# Altium project Cubesat OBC.PrjPcb
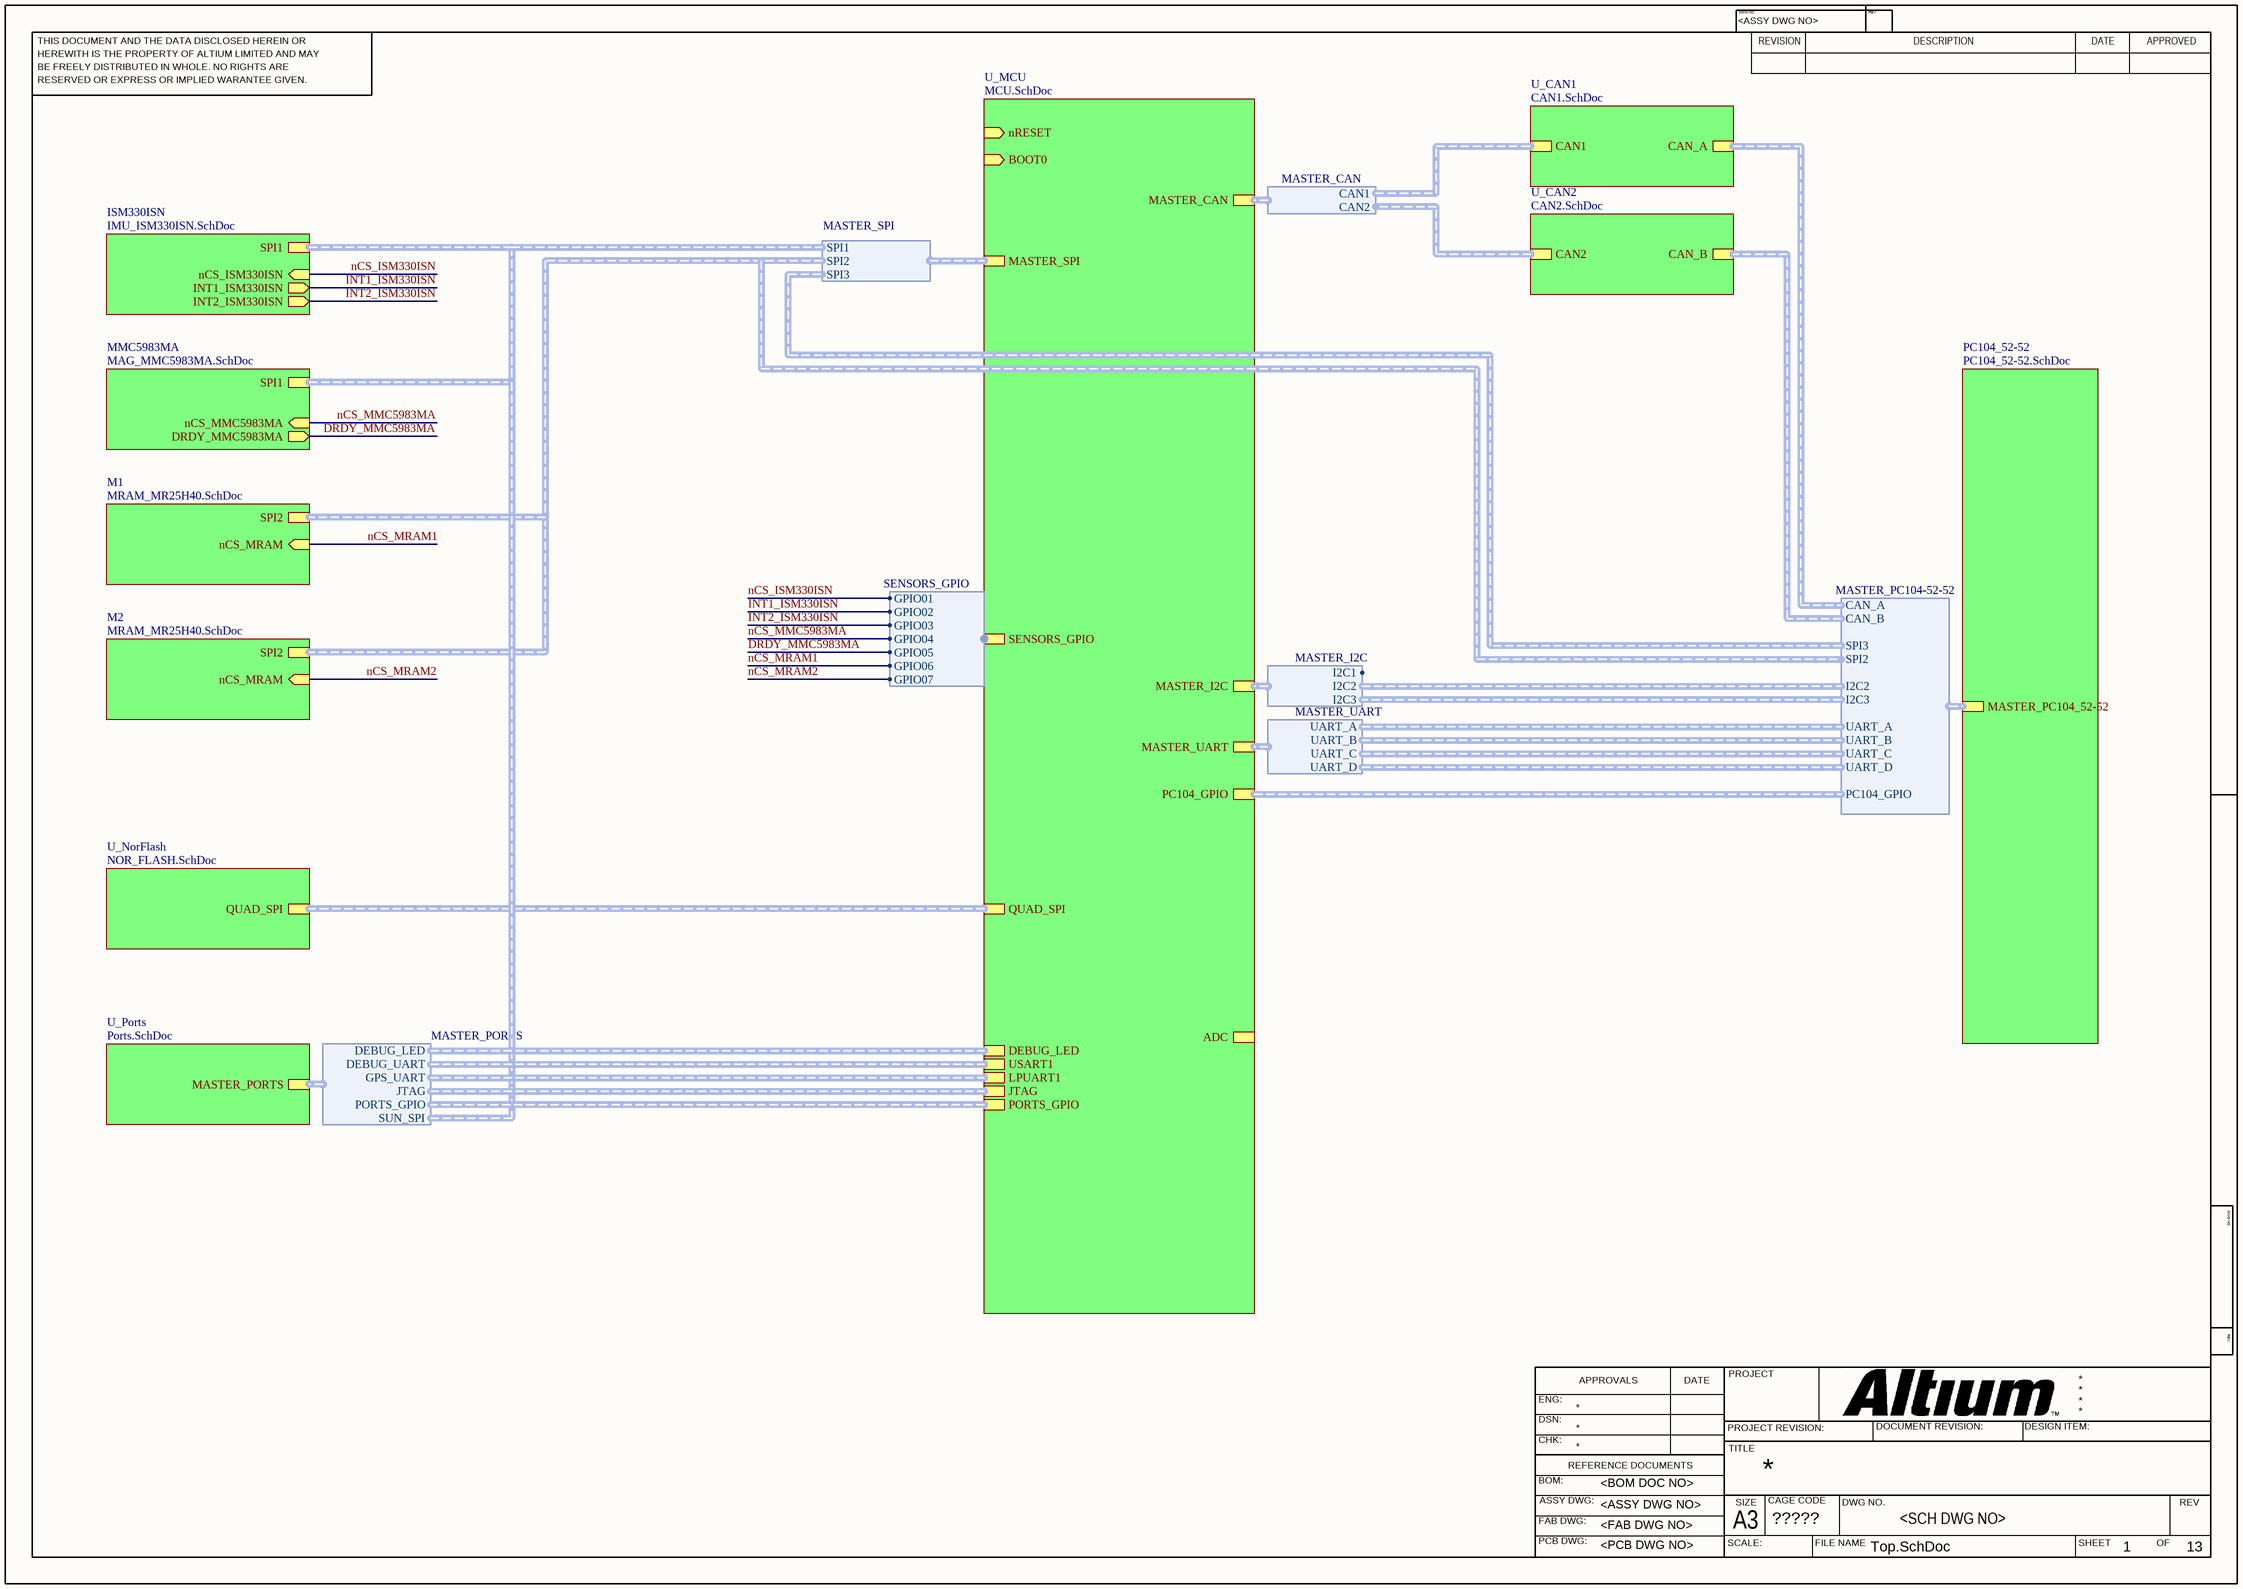
[diagram p0: Top.SchDoc]
CAGE_CODE: ?????; CONTRACT_NUMBER: <CONTRACT NO>; DOC_NO_ASSY_DWG: <ASSY DWG NO>; DOC_NO_BOM: <BOM DOC NO>; DOC_NO_FAB_DWG: <FAB DWG NO>; DOC_NO_SCH_DWG: <SCH DWG NO>; PCB_2_DEC_TOL: +/-.01; PCB_3_DEC_TOL: +/-.010; PCB_ANG_TOL: +/-1/2; PCB_ASSEMBLY_NO: <PCB ASSY NO>; PCB_CHECKER: - -----; PCB_CHECKER_APP_DATE: --/--/----; PCB_DESIGNER: - -----; PCB_DESIGNER_APP_DATE: --/--/----; PCB_DWG_NO: <PCB DWG NO>; PCB_ENGINEER: - -----; PCB_ENGINEER_APP_DATE: --/--/----; PCB_PART_NUMBER: <PCB PN>; PCB_REV: A; SCH_REV: A
5 sheets, 68 parts. Net scope: hierarchical (ports join the sheet entries above them; power ports are global).
Board file: CORE.PcbDoc
Sheets:
  Top.SchDoc
    U_MCU = MCU.SchDoc
      MCU_Power = MCU_Power.SchDoc
    PC104_52-52 = PC104_52-52.SchDoc
    U_Ports = Ports.SchDoc

## Sheet Top.SchDoc
size 420 x 297 mm; SheetNumber: 1; SheetTotal: 13

### Sub-sheets
ISM330ISN = IMU_ISM330ISN.SchDoc (file not in this document): SPI1 (harness SPI1), nCS_ISM330ISN (in), INT1_ISM330ISN (out), INT2_ISM330ISN (out)
M1 = MRAM_MR25H40.SchDoc (file not in this document): nCS_MRAM (in), SPI2 (harness SPI2)
M2 = MRAM_MR25H40.SchDoc (file not in this document): nCS_MRAM (in), SPI2 (harness SPI2)
MMC5983MA = MAG_MMC5983MA.SchDoc (file not in this document): nCS_MMC5983MA (in), SPI1 (harness SPI1), DRDY_MMC5983MA (out)
PC104_52-52 = PC104_52-52.SchDoc: MASTER_PC104_52-52 (harness MASTER_PC104-52-52)
U_CAN1 = CAN1.SchDoc (file not in this document): CAN_A (harness CAN_A), CAN1 (harness CAN1)
U_CAN2 = CAN2.SchDoc (file not in this document): CAN_B (harness CAN_b), CAN2 (harness CAN2)
U_MCU = MCU.SchDoc: MASTER_I2C (harness MASTER_I2C), MASTER_SPI (harness MASTER_SPI), MASTER_UART (harness MASTER_UART), MASTER_CAN (harness MASTER_CAN), QUAD_SPI (harness QUAD_SPI), nRESET (in), BOOT0 (in), JTAG (harness JTAG), DEBUG_LED (harness DEBUG_LED), USART1 (harness USART1), ADC (harness ADC), LPUART1 (harness LPUART1), PC104_GPIO (harness PC104_GPIO), PORTS_GPIO (harness PORTS_GPIO), SENSORS_GPIO (harness SENSORS_GPIO)
U_NorFlash = NOR_FLASH.SchDoc (file not in this document): QUAD_SPI (harness QUAD_SPI)
U_Ports = Ports.SchDoc: MASTER_PORTS (harness MASTER_PORTS)

### Harnesses
MASTER_SPI: SPI1, SPI2, SPI3
MASTER_CAN: CAN1, CAN2
MASTER_UART: UART_A, UART_B, UART_C, UART_D
MASTER_I2C: I2C2, I2C3, I2C1
SENSORS_GPIO: GPIO01, GPIO02, GPIO03, GPIO04, GPIO05, GPIO06, GPIO07
MASTER_PC104-52-52: CAN_A, CAN_B, I2C2, I2C3, PC104_GPIO, SPI2, SPI3, UART_A, UART_B, UART_C, UART_D
MASTER_PORTS: DEBUG_LED, DEBUG_UART, GPS_UART, JTAG, PORTS_GPIO, SUN_SPI

### Nets
DRDY_MMC5983MA: sheet MMC5983MA/DRDY_MMC5983MA, sheet U_MCU/SENSORS_GPIO.GPIO05
INT1_ISM330ISN: sheet ISM330ISN/INT1_ISM330ISN, sheet U_MCU/SENSORS_GPIO.GPIO02
INT2_ISM330ISN: sheet ISM330ISN/INT2_ISM330ISN, sheet U_MCU/SENSORS_GPIO.GPIO03
nCS_ISM330ISN: sheet ISM330ISN/nCS_ISM330ISN, sheet U_MCU/SENSORS_GPIO.GPIO01
nCS_MMC5983MA: sheet MMC5983MA/nCS_MMC5983MA, sheet U_MCU/SENSORS_GPIO.GPIO04
nCS_MRAM1: sheet M1/nCS_MRAM, sheet U_MCU/SENSORS_GPIO.GPIO06
nCS_MRAM2: sheet M2/nCS_MRAM, sheet U_MCU/SENSORS_GPIO.GPIO07

### Buses and harness runs
harness sheet ISM330ISN/SPI1 = sheet MMC5983MA/SPI1
harness sheet M1/SPI2 = sheet M2/SPI2
harness sheet U_MCU/QUAD_SPI = sheet U_NorFlash/QUAD_SPI

### Notes on the sheet
- THIS DOCUMENT AND THE DATA DISCLOSED HEREIN OR
- HEREWITH IS THE PROPERTY OF ALTIUM LIMITED AND MAY
- DWG NO:
- REVISION
- REV:
- DESCRIPTION
- DATE
- APPROVED
- BE FREELY DISTRIBUTED IN WHOLE. NO RIGHTS ARE
- RESERVED OR EXPRESS OR IMPLIED WARANTEE GIVEN.
- ENG:
- APPROVALS
- PROJECT
- DSN:
- CHK:
- REFERENCE DOCUMENTS
- PROJECT REVISION:
- TITLE
- DOCUMENT REVISION:
- DESIGN ITEM:
- BOM:
- FAB DWG:
- PCB DWG:
- ASSY DWG:
- SCALE:
- A3
- SIZE
- CAGE CODE
- FILE NAME
- DWG NO.
- SHEET
- OF
- REV

## Sheet MCU.SchDoc
size 420 x 297 mm; SheetNumber: 2; SheetTotal: 13; ENG_APP_DATE: --/--/--; DSN_APP_DATE: --/--/--; CHK_APP_DATE: --/--/--
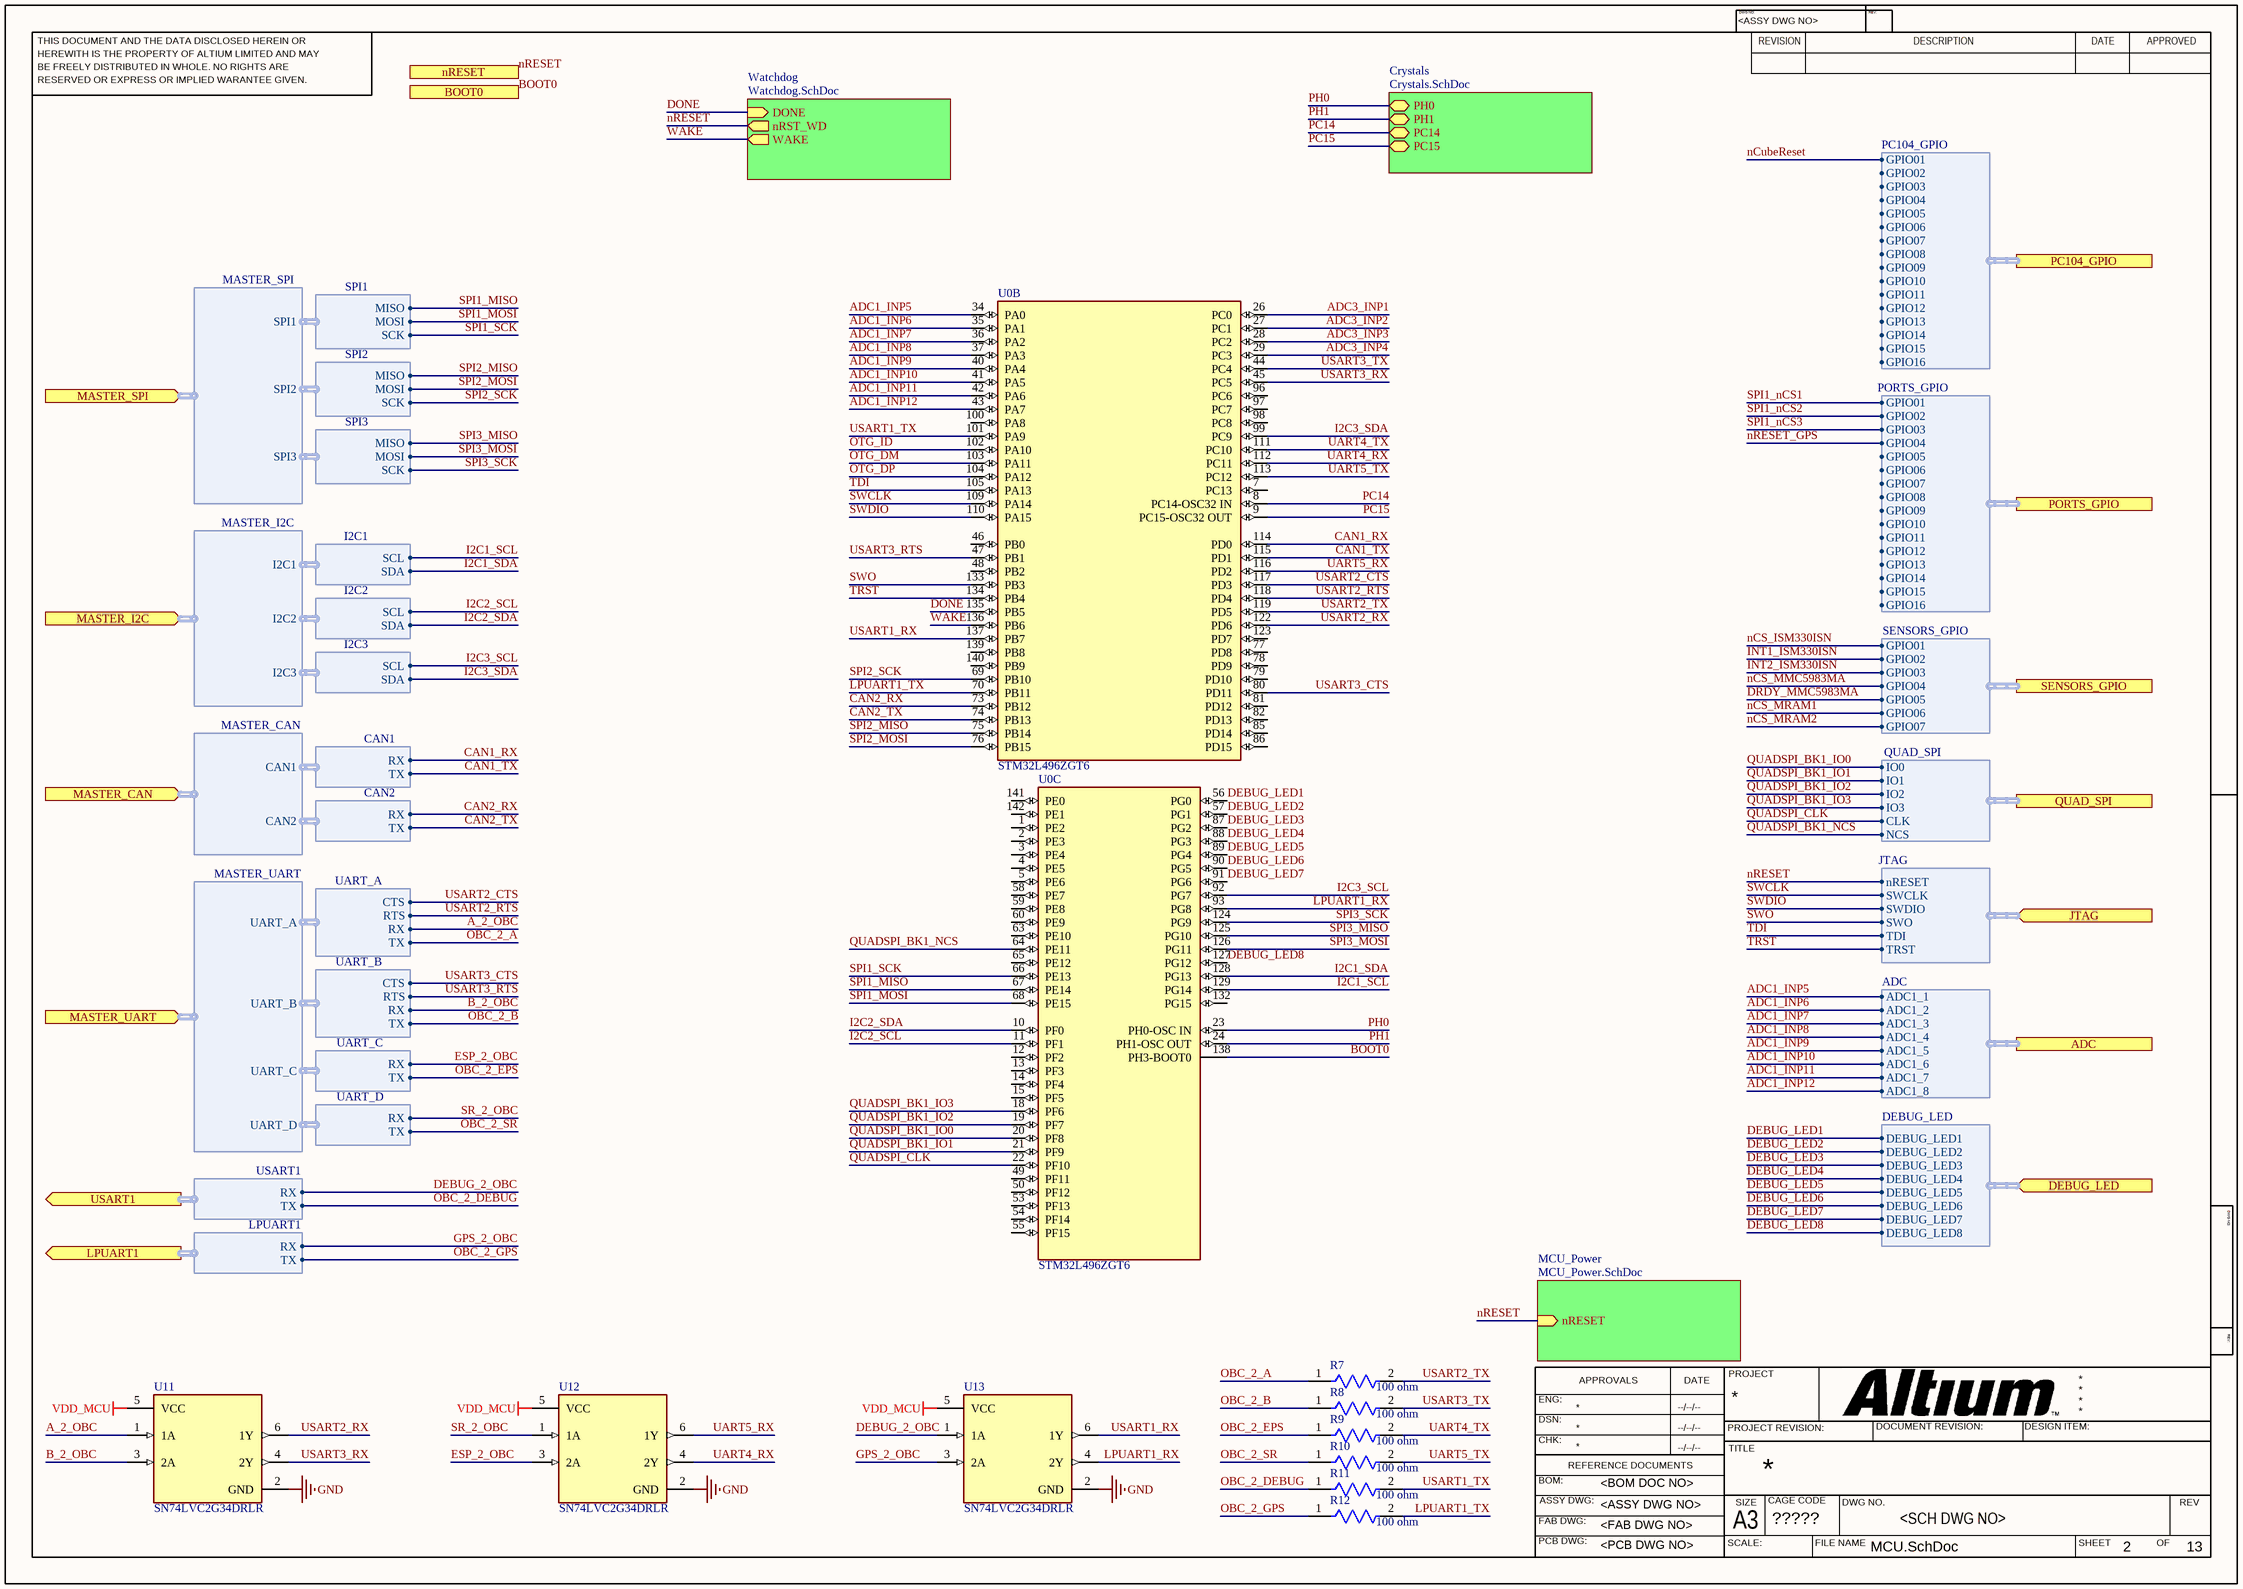
[diagram p1: MCU.SchDoc]

### Parts
R7  100 ohm  [FP-ERJP03-MFG]
R8  100 ohm  [FP-ERJP03-MFG]
R9  100 ohm  [FP-ERJP03-MFG]
R10  100 ohm  [FP-ERJP03-MFG]
R11  100 ohm  [FP-ERJP03-MFG]
R12  100 ohm  [FP-ERJP03-MFG]
U0  STM32L496ZGT6  [FP-LQFP144-1A-MFG]  (parts B,C of 3)
U11  SN74LVC2G34DRLR  [FP-DRL0006A-MFG]
U12  SN74LVC2G34DRLR  [FP-DRL0006A-MFG]
U13  SN74LVC2G34DRLR  [FP-DRL0006A-MFG]

### Sub-sheets
Crystals = Crystals.SchDoc (file not in this document): PC14 (bidir), PC15 (bidir), PH0 (bidir), PH1 (bidir)
MCU_Power = MCU_Power.SchDoc: nRESET (in)
Watchdog = Watchdog.SchDoc (file not in this document): nRST_WD (out), DONE (in), WAKE (out)

### Ports
ADC (harness ADC), BOOT0 (in), DEBUG_LED (in, harness DEBUG_LED), JTAG (in, harness JTAG), LPUART1 (out, harness LPUART1), MASTER_CAN (in, harness MASTER_CAN), MASTER_I2C (in, harness MASTER_I2C), MASTER_SPI (in, harness MASTER_SPI), MASTER_UART (in, harness MASTER_UART), nRESET (in), PC104_GPIO (harness PC104_GPIO), PORTS_GPIO (harness PORTS_GPIO), QUAD_SPI (harness QUAD_SPI), SENSORS_GPIO (harness SENSORS_GPIO), USART1 (out, harness USART1)

### Harnesses
MASTER_I2C: I2C1, I2C2, I2C3
MASTER_UART: UART_A, UART_B, UART_C, UART_D
I2C1: SDA, SCL
MASTER_SPI: SPI1, SPI2, SPI3
SPI1: MOSI, MISO, SCK
SPI2: MOSI, MISO, SCK
SPI3: MISO, SCK, MOSI
MASTER_CAN: CAN1, CAN2
CAN1: TX, RX
CAN2: TX, RX
ADC: ADC1_1, ADC1_2, ADC1_3, ADC1_4, ADC1_5, ADC1_6, ADC1_7, ADC1_8
JTAG: nRESET, SWCLK, SWDIO, SWO, TDI, TRST
I2C2: SDA, SCL
UART_A: TX, RX, RTS, CTS
UART_B: TX, RX, RTS, CTS
QUAD_SPI: IO0, IO1, CLK, NCS, IO2, IO3
I2C3: SDA, SCL
USART1: TX, RX
LPUART1: TX, RX
UART_D: TX, RX
UART_C: RX, TX
DEBUG_LED: DEBUG_LED1, DEBUG_LED2, DEBUG_LED3, DEBUG_LED4, DEBUG_LED5, DEBUG_LED6, DEBUG_LED7, DEBUG_LED8
SENSORS_GPIO: GPIO01, GPIO02, GPIO03, GPIO04, GPIO05, GPIO06, GPIO07
PORTS_GPIO: GPIO01, GPIO02, GPIO03, GPIO04, GPIO05, GPIO06, GPIO07, GPIO08, GPIO09, GPIO10, GPIO11, GPIO12, GPIO13, GPIO14, GPIO15, GPIO16
PC104_GPIO: GPIO01, GPIO02, GPIO03, GPIO04, GPIO05, GPIO06, GPIO07, GPIO08, GPIO09, GPIO10, GPIO11, GPIO12, GPIO13, GPIO14, GPIO15, GPIO16

### Nets
GND: U11.2(GND) U12.2(GND) U13.2(GND)
VDD_MCU: U11.5(VCC) U12.5(VCC) U13.5(VCC)
A_2_OBC: U11.1(1A) ; harness UART_A.RX
ADC1_INP5: U0.34(PA0) ; port ADC.ADC1_1
ADC1_INP6: U0.35(PA1) ; port ADC.ADC1_2
ADC1_INP7: U0.36(PA2) ; port ADC.ADC1_3
ADC1_INP8: U0.37(PA3) ; port ADC.ADC1_4
ADC1_INP9: U0.40(PA4) ; port ADC.ADC1_5
ADC1_INP10: U0.41(PA5) ; port ADC.ADC1_6
ADC1_INP11: U0.42(PA6) ; port ADC.ADC1_7
ADC1_INP12: U0.43(PA7) ; port ADC.ADC1_8
ADC3_INP1: U0.26(PC0)
ADC3_INP2: U0.27(PC1)
ADC3_INP3: U0.28(PC2)
ADC3_INP4: U0.29(PC3)
B_2_OBC: U11.3(2A) ; harness UART_B.RX
BOOT0: U0.138(PH3-BOOT0) ; port BOOT0
CAN1_RX: U0.114(PD0) ; harness CAN1.RX
CAN1_TX: U0.115(PD1) ; harness CAN1.TX
CAN2_RX: U0.73(PB12) ; harness CAN2.RX
CAN2_TX: U0.74(PB13) ; harness CAN2.TX
DEBUG_2_OBC: U13.1(1A) ; port USART1.RX
DEBUG_LED1: U0.56(PG0) ; port DEBUG_LED.DEBUG_LED1
DEBUG_LED2: U0.57(PG1) ; port DEBUG_LED.DEBUG_LED2
DEBUG_LED3: U0.87(PG2) ; port DEBUG_LED.DEBUG_LED3
DEBUG_LED4: U0.88(PG3) ; port DEBUG_LED.DEBUG_LED4
DEBUG_LED5: U0.89(PG4) ; port DEBUG_LED.DEBUG_LED5
DEBUG_LED6: U0.90(PG5) ; port DEBUG_LED.DEBUG_LED6
DEBUG_LED7: U0.91(PG6) ; port DEBUG_LED.DEBUG_LED7
DEBUG_LED8: U0.127(PG12) ; port DEBUG_LED.DEBUG_LED8
DONE: U0.135(PB5) ; sheet Watchdog/DONE
ESP_2_OBC: U12.3(2A) ; harness UART_C.RX
GPS_2_OBC: U13.3(2A) ; port LPUART1.RX
I2C1_SCL: U0.129(PG14) ; harness I2C1.SCL
I2C1_SDA: U0.128(PG13) ; harness I2C1.SDA
I2C2_SCL: U0.11(PF1) ; harness I2C2.SCL
I2C2_SDA: U0.10(PF0) ; harness I2C2.SDA
I2C3_SCL: U0.92(PG7) ; harness I2C3.SCL
I2C3_SDA: U0.99(PC9) ; harness I2C3.SDA
LPUART1_RX: U0.93(PG8) U13.4(2Y)
LPUART1_TX: R12.2 U0.70(PB11)
nRESET: port nRESET, sheet MCU_Power/nRESET, sheet Watchdog/nRST_WD, port JTAG.nRESET
OBC_2_A: R7.1 ; harness UART_A.TX
OBC_2_B: R8.1 ; harness UART_B.TX
OBC_2_DEBUG: R11.1 ; port USART1.TX
OBC_2_EPS: R9.1 ; harness UART_C.TX
OBC_2_GPS: R12.1 ; port LPUART1.TX
OBC_2_SR: R10.1 ; harness UART_D.TX
OTG_DM: U0.103(PA11)
OTG_DP: U0.104(PA12)
OTG_ID: U0.102(PA10)
PC14: U0.8(PC14-OSC32_IN) ; sheet Crystals/PC14
PC15: U0.9(PC15-OSC32_OUT) ; sheet Crystals/PC15
PH0: U0.23(PH0-OSC_IN) ; sheet Crystals/PH0
PH1: U0.24(PH1-OSC_OUT) ; sheet Crystals/PH1
QUADSPI_BK1_IO0: U0.20(PF8) ; port QUAD_SPI.IO0
QUADSPI_BK1_IO1: U0.21(PF9) ; port QUAD_SPI.IO1
QUADSPI_BK1_IO2: U0.19(PF7) ; port QUAD_SPI.IO2
QUADSPI_BK1_IO3: U0.18(PF6) ; port QUAD_SPI.IO3
QUADSPI_BK1_NCS: U0.64(PE11) ; port QUAD_SPI.NCS
QUADSPI_CLK: U0.22(PF10) ; port QUAD_SPI.CLK
SPI1_MISO: U0.67(PE14) ; harness SPI1.MISO
SPI1_MOSI: U0.68(PE15) ; harness SPI1.MOSI
SPI1_SCK: U0.66(PE13) ; harness SPI1.SCK
SPI2_MISO: U0.75(PB14) ; harness SPI2.MISO
SPI2_MOSI: U0.76(PB15) ; harness SPI2.MOSI
SPI2_SCK: U0.69(PB10) ; harness SPI2.SCK
SPI3_MISO: U0.125(PG10) ; harness SPI3.MISO
SPI3_MOSI: U0.126(PG11) ; harness SPI3.MOSI
SPI3_SCK: U0.124(PG9) ; harness SPI3.SCK
SR_2_OBC: U12.1(1A) ; harness UART_D.RX
SWCLK: U0.109(PA14) ; port JTAG.SWCLK
SWDIO: U0.110(PA15) ; port JTAG.SWDIO
SWO: U0.133(PB3) ; port JTAG.SWO
TDI: U0.105(PA13) ; port JTAG.TDI
TRST: U0.134(PB4) ; port JTAG.TRST
UART4_RX: U0.112(PC11) U12.4(2Y)
UART4_TX: R9.2 U0.111(PC10)
UART5_RX: U0.116(PD2) U12.6(1Y)
UART5_TX: R10.2 U0.113(PC12)
USART1_RX: U0.137(PB7) U13.6(1Y)
USART1_TX: R11.2 U0.101(PA9)
USART2_CTS: U0.117(PD3) ; harness UART_A.CTS  [project net UART_A_CTS]
USART2_RTS: U0.118(PD4) ; harness UART_A.RTS  [project net UART_A_RTS]
USART2_RX: U0.122(PD6) U11.6(1Y)
USART2_TX: R7.2 U0.119(PD5)
USART3_CTS: U0.80(PD11) ; harness UART_B.CTS  [project net UART_B_CTS]
USART3_RTS: U0.47(PB1) ; harness UART_B.RTS  [project net UART_B_RTS]
USART3_RX: U0.45(PC5) U11.4(2Y)
USART3_TX: R8.2 U0.44(PC4)
WAKE: U0.136(PB6) ; sheet Watchdog/WAKE

Not connected (* = marked no-connect by the designer): U0 1(PE2) 2(PE3) 3(PE4) 4(PE5) 5(PE6) 7(PC13) 12(PF2) 13(PF3) 14(PF4) 15(PF5) 46(PB0) 48(PB2) 49(PF11) 50(PF12) 53(PF13) 54(PF14) 55(PF15) 58(PE7) 59(PE8) 60(PE9) 63(PE10) 65(PE12) 77(PD8) 78(PD9) 79(PD10) 81(PD12) 82(PD13) 85(PD14) 86(PD15) 96(PC6) 97(PC7) 98(PC8) 100(PA8) 123(PD7) 132(PG15) 139(PB8) 140(PB9) 141(PE0) 142(PE1)

### Notes on the sheet
- THIS DOCUMENT AND THE DATA DISCLOSED HEREIN OR
- HEREWITH IS THE PROPERTY OF ALTIUM LIMITED AND MAY
- DWG NO:
- REVISION
- REV:
- DESCRIPTION
- DATE
- APPROVED
- BE FREELY DISTRIBUTED IN WHOLE. NO RIGHTS ARE
- RESERVED OR EXPRESS OR IMPLIED WARANTEE GIVEN.
- ENG:
- APPROVALS
- PROJECT
- DSN:
- CHK:
- REFERENCE DOCUMENTS
- PROJECT REVISION:
- TITLE
- DOCUMENT REVISION:
- DESIGN ITEM:
- BOM:
- FAB DWG:
- PCB DWG:
- ASSY DWG:
- SCALE:
- A3
- SIZE
- CAGE CODE
- FILE NAME
- DWG NO.
- SHEET
- OF
- REV

### Library data of the parts
R7-R12 = CMP-00287-21317759-1: ERJ-P03F1000V SMD Chip Resistor, 100 Ohm, ± 1%, 200 mW, 0603 [1608 Metric], Thick Film, Anti-Surge; Temperature Coefficient: 200ppm/°C; Resistance: 100Ω; Voltage Rating (DC): 150V; Power Rating: 200mW; Tolerance: 1%; Termination: Tab; RoHS: Compliant; Composition: Thick Film; Min Operating Temperature: -55°C; Contact Plating: Tin; Case Code (Metric): 1608; Case/Package: 0603; Radiation Hardening: No; Mount: Surface Mount; Voltage Rating: 150V; Packaging: Cut Tape; Length: 1.6mm; REACH SVHC: No SVHC; Max Operating Temperature: 155°C; Depth: 800µm; Number of Pins: 2; Lifecycle Status: Production; Schedule B: 8533210045, 8533210045; Military Standard: Not; Height: 550µm; NexarPartId: 21317759; Case Code (Imperial): 0603
U0 = CMP-12105-000038-2: IC MCU 32BIT 1MB FLASH 144LQFP; Manufacturer Package Identifier: LQFP144-1A; NexarPartId: 80927210; Number of Channels: 24; Number of I2C Channels: 4; Frequency: 80MHz; Number of USB Channels: 1; Nominal Supply Current: 30nA; Data Bus Width: 32b; Number of Timers/Counters: 2; Number of USART Channels: 3; Max Junction Temperature (Tj): 105°C; Number of I/Os: 115; Number of PWM Channels: 28; Interface: CAN, I2C, I2S, IrDA, LIN, SPI, UART, USART, USB; Core Architecture: ARM Cortex-M4; RAM Size: 320kB; Min Supply Voltage: 1.05V; Max Supply Voltage: 3.6V; Min Operating Temperature: -40°C; RoHS: Non-Compliant; Memory Size: 1MB; Number of A/D Converters: 3; Number of SPI Channels: 3; Max Operating Temperature: 85°C; Memory Type: FLASH; Height: 1.6mm; Ambient Temperature Range High: 85°C; Schedule B: 8542310000, 8542310000; Number of D/A Converters: 2; Number of UART Channels: 2; Lifecycle Status: Production; Flash Memory Size: 1MB; Number of ADC Channels: 24
U11-U13 = CMP-0859-00812-4: IC BUFFER NON-INVERT 5.5V 6SOT; Number of Bits per Element: 1; Number of Bits: 2; Low Level Output Current: 32mA; Polarity: Non-Inverting; Min Supply Voltage: 1.65V; Propagation Delay: 8.6ns; High Level Output Current: -32mA; Quiescent Current: 10uA; Contact Plating: Gold; Case/Package: SOT; Technology: CMOS; Min Operating Temperature: -40°C; Number of Elements: 2; REACH SVHC: No SVHC; Number of Channels: 2; Series: 74LVC; Number of Pins: 6; Mount: Surface Mount; Logic Function: Buffer; Number of Output Lines: 2; Packaging: Tape and Reel; Package Quantity: 4000; Radiation Hardening: No; Number of Gates: 2; Turn-On Delay Time: 8.6ns; Max Operating Temperature: 125°C; Max Supply Voltage: 5.5V; Lead Free: Lead Free; RoHS Compliant: Yes; Number of Outputs: 2; Number of Inputs: 2; Number of Input Lines: 2

## Sheet MCU_Power.SchDoc
size 420 x 297 mm; SheetNumber: 3; SheetTotal: 13
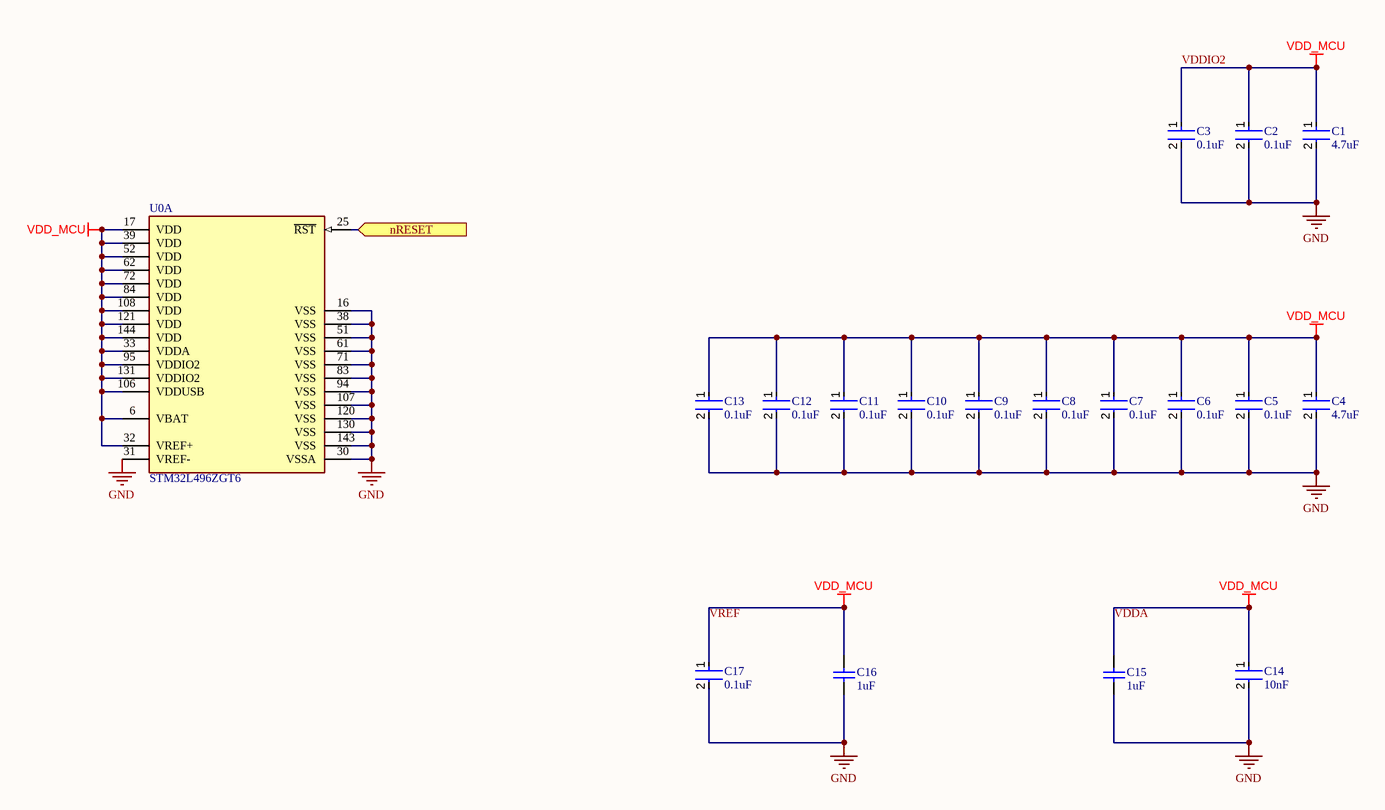
[diagram p2: MCU_Power.SchDoc]

### Parts
C1  4.7uF  [FP-GRM188-0_15-IPC_A]
C2  0.1uF  [FP-C0603C-CF-MFG]
C3  0.1uF  [FP-C0603C-CF-MFG]
C4  4.7uF  [FP-GRM188-0_15-IPC_A]
C5  0.1uF  [FP-C0603C-CF-MFG]
C6  0.1uF  [FP-C0603C-CF-MFG]
C7  0.1uF  [FP-C0603C-CF-MFG]
C8  0.1uF  [FP-C0603C-CF-MFG]
C9  0.1uF  [FP-C0603C-CF-MFG]
C10  0.1uF  [FP-C0603C-CF-MFG]
C11  0.1uF  [FP-C0603C-CF-MFG]
C12  0.1uF  [FP-C0603C-CF-MFG]
C13  0.1uF  [FP-C0603C-CF-MFG]
C14  10nF  [FP-GRM188-0_1-e0_2_0_5-IPC_A]
C15  1uF  [CAPC1608X90X35LL15T15]
C16  1uF  [CAPC1608X90X35LL15T15]
C17  0.1uF  [FP-C0603C-CF-MFG]
U0  STM32L496ZGT6  [FP-LQFP144-1A-MFG]  (part A of 3)

### Ports
nRESET (in)

### Nets
GND: C1.2 C2.2 C3.2 C4.2 C5.2 C6.2 C7.2 C8.2 C9.2 C10.2 C11.2 C12.2 C13.2 C14.2 C15.1 C16.1 C17.2 U0.16(VSS) U0.30(VSSA) U0.31(VREF-) U0.38(VSS) U0.51(VSS) U0.61(VSS) U0.71(VSS) U0.83(VSS) U0.94(VSS) U0.107(VSS) U0.120(VSS) U0.130(VSS) U0.143(VSS)
VDD_MCU: C1.1 C2.1 C3.1 C4.1 C5.1 C6.1 C7.1 C8.1 C9.1 C10.1 C11.1 C12.1 C13.1 C14.1 C15.2 C16.2 C17.1 U0.6(VBAT) U0.17(VDD) U0.32(VREF+) U0.33(VDDA) U0.39(VDD) U0.52(VDD) U0.62(VDD) U0.72(VDD) U0.84(VDD) U0.95(VDDIO2) U0.106(VDDUSB) U0.108(VDD) U0.121(VDD) U0.131(VDDIO2) U0.144(VDD)  [also labelled VDDA, VDDIO2, VREF]
nRESET: U0.25(~{RST}) ; port nRESET

### Notes on the sheet
- THIS DOCUMENT AND THE DATA DISCLOSED HEREIN OR
- HEREWITH IS THE PROPERTY OF ALTIUM LIMITED AND MAY
- DWG NO:
- REVISION
- REV:
- DESCRIPTION
- DATE
- APPROVED
- BE FREELY DISTRIBUTED IN WHOLE. NO RIGHTS ARE
- RESERVED OR EXPRESS OR IMPLIED WARANTEE GIVEN.
- ENG:
- APPROVALS
- PROJECT
- DSN:
- CHK:
- REFERENCE DOCUMENTS
- PROJECT REVISION:
- TITLE
- DOCUMENT REVISION:
- DESIGN ITEM:
- BOM:
- FAB DWG:
- PCB DWG:
- ASSY DWG:
- SCALE:
- A3
- SIZE
- CAGE CODE
- FILE NAME
- DWG NO.
- SHEET
- OF
- REV

### Library data of the parts
C1 C4 = CMP-06035-000034-2: CAP CER 4.7UF 10V X7S 0603; Material: Ceramic; Tolerance: 10%; Height: 0.8mm; Termination: SMD/SMT; Case Code (Metric): 1608; Voltage Rating: 10V; Width: 0.8mm; Resistor Type: Ceramic; Length: 1.6mm; Voltage Rating (DC): 10V; Weight: 0.000222oz; Dielectric: X7S; Package Quantity: 4000; Mount: Surface Mount; Case Code (Imperial): 0603; Case/Package: 0603; Packaging: Tape and Reel; Thickness: 0.037inch; Min Operating Temperature: -55°C; Capacitance: 4.7uF; Max Operating Temperature: 125°C
C2 C3 C5-C13 C17 = CMP-2006-03061-2: CAP CER 0.1UF 50V X7R 0603; Manufacturer: KEMET; Manufacturer Part Number: C0603C104K5RACTU; Tolerance: 0.1; Temperature Coefficient: 30ppm/°C; Material: Ceramic; Automotive Grade: Grade 1; Value: 0.10 μF; Temperature: -55°C to +125°C; RoHS: TRUE; Temperature Range High: +125°C; Lead Free: Yes; Octopart: https://octopart.com/c0603c104k5ractu-kemet-139244; Digikey Description: CAP CER 0.1UF 50V X7R 0603; Category: Cap; Package: C0603C-CF; ComponentLink2Description: Datasheet; Temperature Range Low: -55°C; Device Class L1: Passive Components; Voltage Rating: 50 V; Automotive: Yes; Device Class L3: Ceramic Capacitors; ComponentLink2URL: https://api.kemet.com/component-edge/download/datasheet/C0603C100J5GACAUTO.pdf; Capacitance: 0.10 μF; Device Class L2: Capacitors; Temperature Characteristic: X7R; Height: 0.87mm
C14 = CMP-2006-02943-2: Chip Multilayer Ceramic Capacitors for General Purpose, 0603, 10000pF, X7R, 15%, 10%, 100V; Capacitance: 10nF; Dielectric: X7R; Material: Ceramic; Package Quantity: 4000; Voltage: 100V; Mount: Surface Mount; Min Operating Temperature: -55°C; Thickness: 0.035inch; Height: 0.8mm; Max Operating Temperature: 125°C; Radiation Hardening: No; Lead Free: Lead Free; Case Code (Metric): 1608; REACH SVHC: No SVHC; Termination: SMD/SMT; Tolerance: 10%; Voltage Rating: 100V; Voltage Rating (DC): 100V; Length: 1.6mm; Depth: 0.8mm; Width: 0.031inch; Case Code (Imperial): 0603; Case/Package: 0603; Packaging: Tape and Reel
C15 C16 = CMP-2006-02298-2: Manufacturer: Kemet; Part Number: C0603C105K4RACTU
U0 = CMP-12105-000038-2: as U0 on sheet MCU; Min Operating Temperature: -40°C; RoHS: Non-Compliant; Memory Size: 1MB; Number of A/D Converters: 3; Number of SPI Channels: 3; Max Operating Temperature: 85°C; Memory Type: FLASH; Height: 1.6mm; Ambient Temperature Range High: 85°C; Schedule B: 8542310000, 8542310000; Number of D/A Converters: 2; Number of UART Channels: 2; Lifecycle Status: Production; Flash Memory Size: 1MB; Number of ADC Channels: 24

## Sheet PC104_52-52.SchDoc
size 420 x 297 mm; SheetNumber: 8; SheetTotal: 13
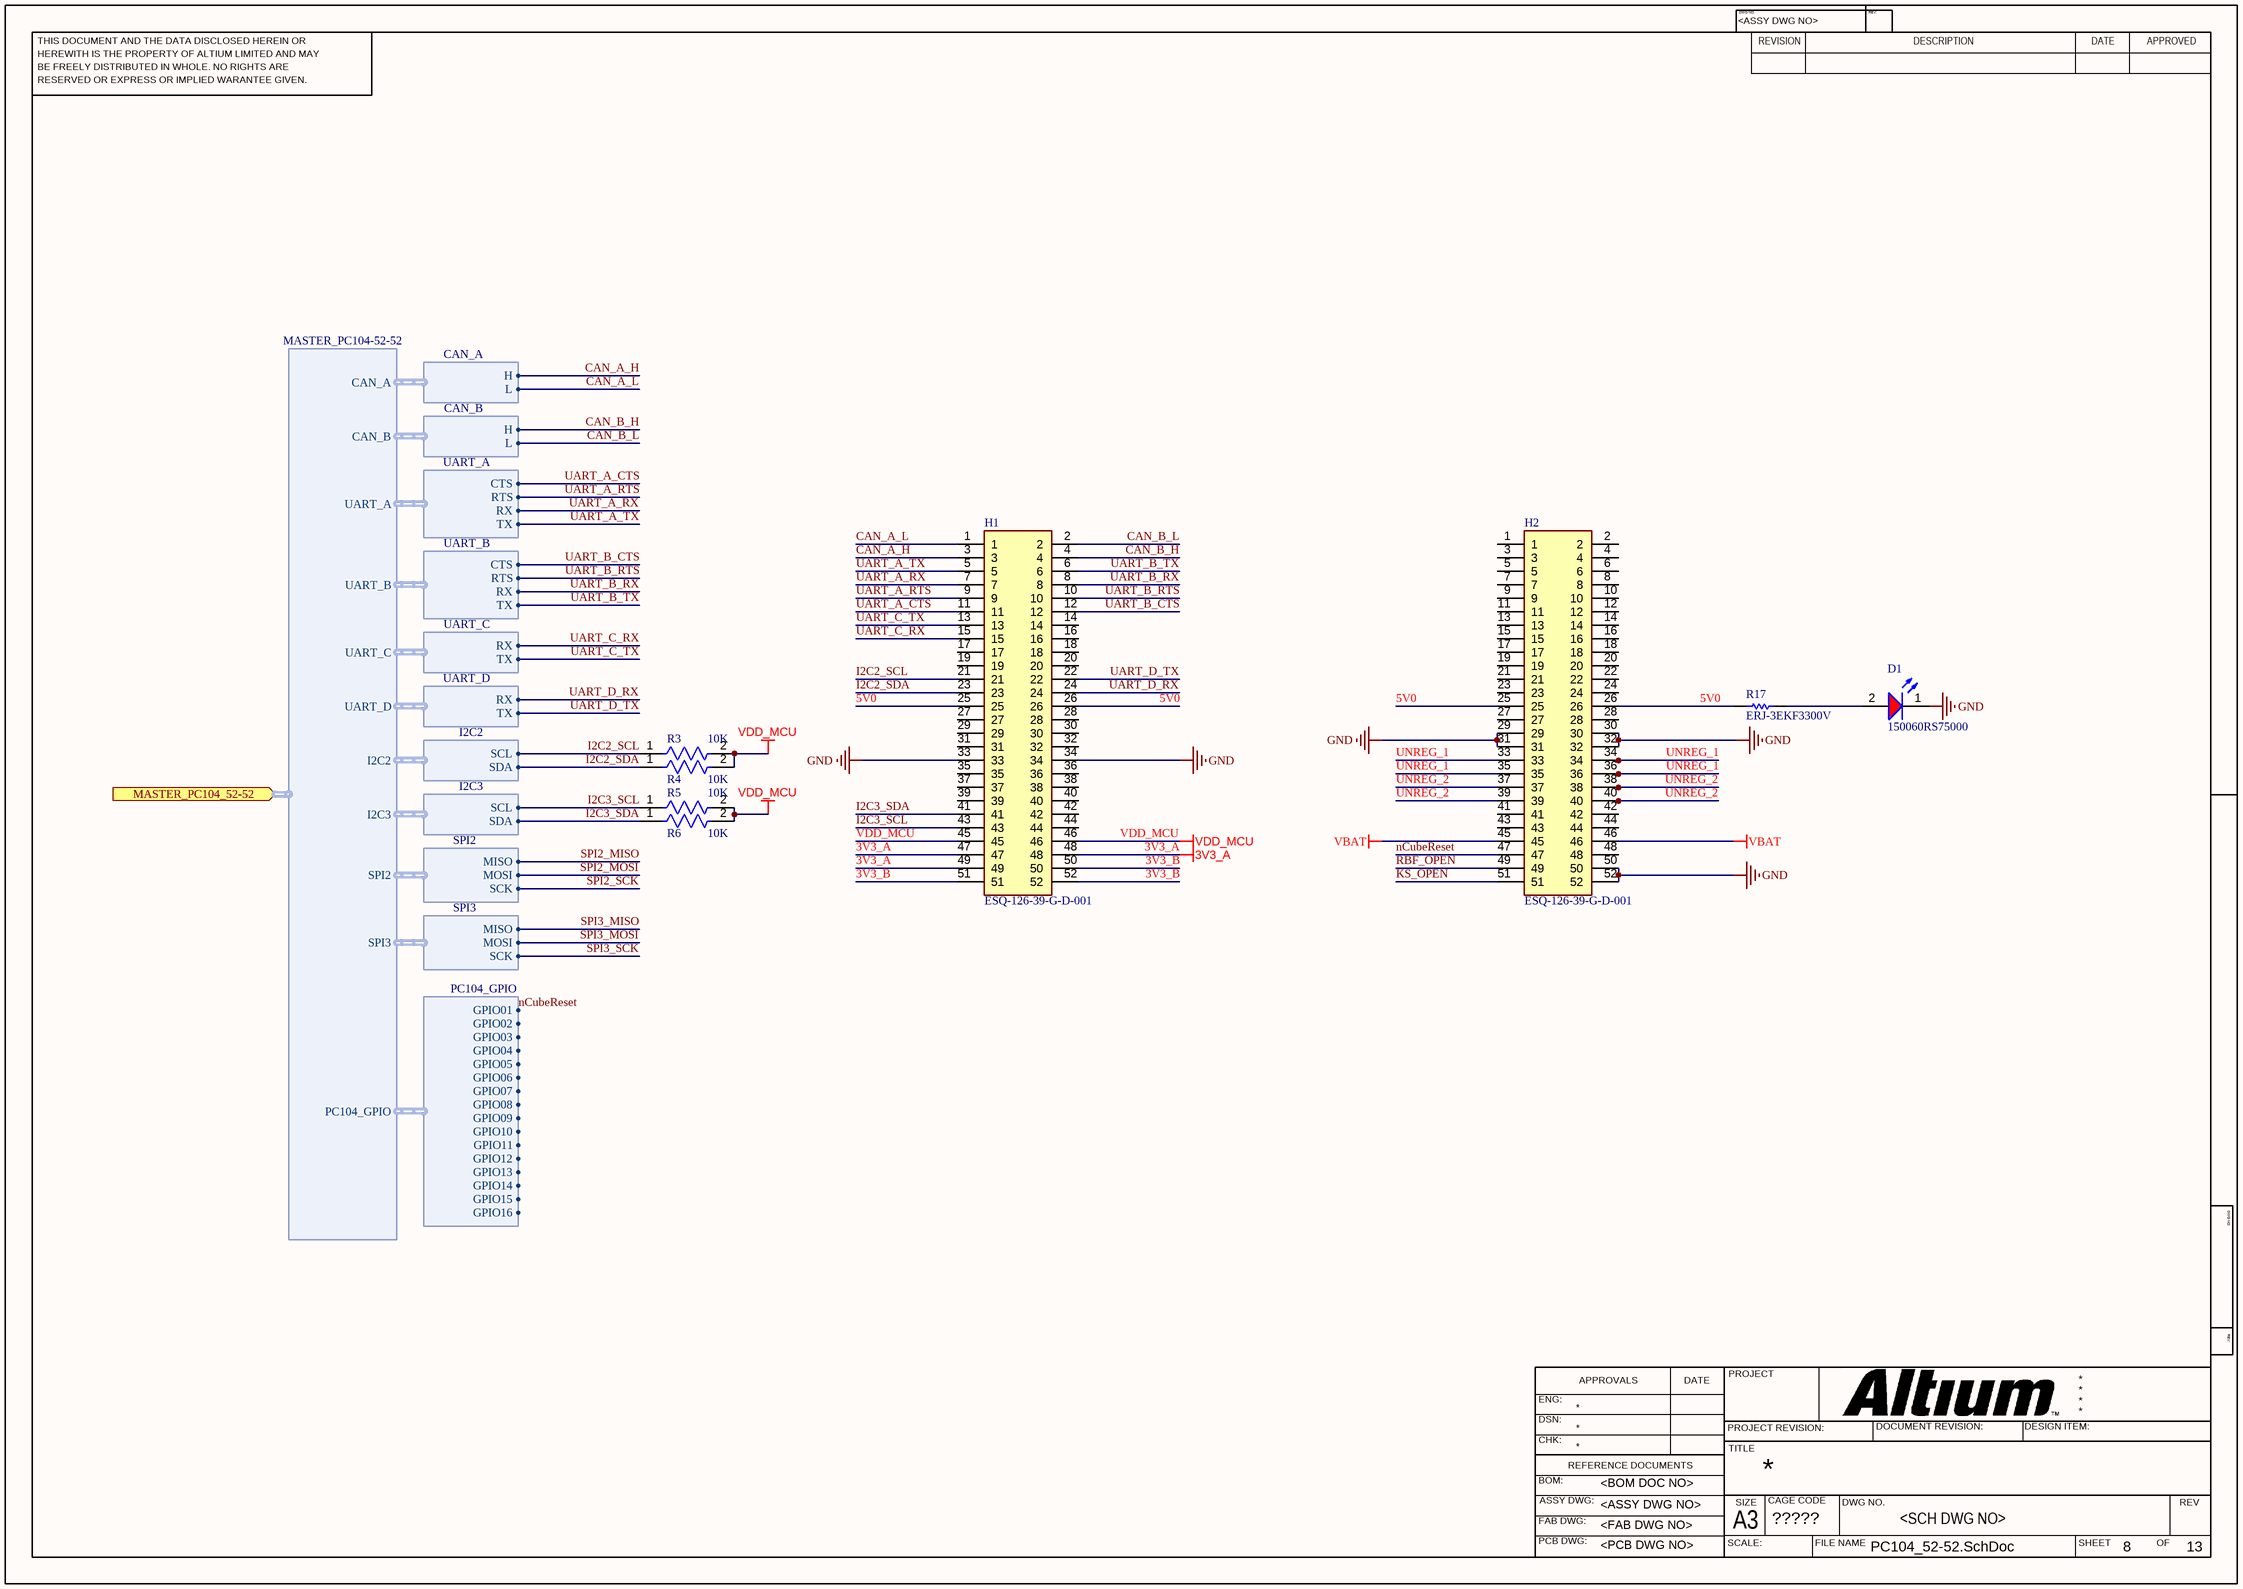
[diagram p3: PC104_52-52.SchDoc]

### Parts
D1  150060RS75000  [WL-SMCW_0603_150060xx75000]
H1  ESQ-126-39-G-D-001  [RHDR52W64P254_2X26_6654X495X1135P]
H2  ESQ-126-39-G-D-001  [RHDR52W64P254_2X26_6654X495X1135P]
R3  10K  [FP-RK73B1J-MFG]
R4  10K  [FP-RK73B1J-MFG]
R5  10K  [FP-RK73B1J-MFG]
R6  10K  [FP-RK73B1J-MFG]
R17  ERJ-3EKF3300V  [RESC1608X55X30LL15T15]

### Ports
MASTER_PC104_52-52 (in, harness MASTER_PC104-52-52)

### Harnesses
MASTER_PC104-52-52: CAN_A, CAN_B, UART_A, UART_B, UART_C, UART_D, I2C2, I2C3, SPI3, SPI2, PC104_GPIO
I2C2: SDA, SCL
I2C3: SDA, SCL
UART_C: TX, RX
UART_D: TX, RX
UART_A: TX, RX, RTS, CTS
UART_B: TX, RX, RTS, CTS
CAN_A: L, H
CAN_B: L, H
SPI2: MOSI, MISO, SCK
SPI3: MISO, SCK, MOSI
PC104_GPIO: GPIO01, GPIO02, GPIO03, GPIO04, GPIO05, GPIO06, GPIO07, GPIO08, GPIO09, GPIO10, GPIO11, GPIO12, GPIO13, GPIO14, GPIO15, GPIO16

### Nets
3V3_A: H1.47 H1.48 H1.49
GND: D1.1(K) H1.33 H1.34 H2.29 H2.30 H2.31 H2.32 H2.50 H2.52
VBAT: H2.45 H2.46
VDD_MCU: H1.45 H1.46 R3.2 R4.2 R5.2 R6.2
3V3_B: H1.50 H1.51 H1.52
5V0: H1.25 H1.26 H2.25 H2.26 R17.1
CAN_A_H: H1.3 ; harness CAN_A.H
CAN_A_L: H1.1 ; harness CAN_A.L
CAN_B_H: H1.4 ; harness CAN_B.H
CAN_B_L: H1.2 ; harness CAN_B.L
I2C2_SCL: H1.21 R3.1 ; harness I2C2.SCL
I2C2_SDA: H1.23 R4.1 ; harness I2C2.SDA
I2C3_SCL: H1.43 R5.1 ; harness I2C3.SCL
I2C3_SDA: H1.41 R6.1 ; harness I2C3.SDA
KS_OPEN: H2.51
nCubeReset: H2.47 ; harness PC104_GPIO.GPIO01
RBF_OPEN: H2.49
UART_A_CTS: H1.11 ; harness UART_A.CTS
UART_A_RTS: H1.9 ; harness UART_A.RTS
UART_A_RX: H1.7 ; harness UART_A.RX  [project net A_2_OBC]
UART_A_TX: H1.5 ; harness UART_A.TX  [project net OBC_2_A]
UART_B_CTS: H1.12 ; harness UART_B.CTS
UART_B_RTS: H1.10 ; harness UART_B.RTS
UART_B_RX: H1.8 ; harness UART_B.RX  [project net B_2_OBC]
UART_B_TX: H1.6 ; harness UART_B.TX  [project net OBC_2_B]
UART_C_RX: H1.15 ; harness UART_C.RX  [project net ESP_2_OBC]
UART_C_TX: H1.13 ; harness UART_C.TX  [project net OBC_2_EPS]
UART_D_RX: H1.24 ; harness UART_D.RX  [project net SR_2_OBC]
UART_D_TX: H1.22 ; harness UART_D.TX  [project net OBC_2_SR]
UNREG_1: H2.33 H2.34 H2.35 H2.36
UNREG_2: H2.37 H2.38 H2.39 H2.40
NetD1_2: D1.2(A) R17.2

Not connected (* = marked no-connect by the designer): H1 14 16 17 18 19 20 27 28 29 30 31 32 35 36 37 38 39 40 42 44; H2 1 2 3 4 5 6 7 8 9 10 11 12 13 14 15 16 17 18 19 20 21 22 23 24 27 28 41 42 43 44 48

### Notes on the sheet
- THIS DOCUMENT AND THE DATA DISCLOSED HEREIN OR
- HEREWITH IS THE PROPERTY OF ALTIUM LIMITED AND MAY
- DWG NO:
- REVISION
- REV:
- DESCRIPTION
- DATE
- APPROVED
- BE FREELY DISTRIBUTED IN WHOLE. NO RIGHTS ARE
- RESERVED OR EXPRESS OR IMPLIED WARANTEE GIVEN.
- ENG:
- APPROVALS
- PROJECT
- DSN:
- CHK:
- REFERENCE DOCUMENTS
- PROJECT REVISION:
- TITLE
- DOCUMENT REVISION:
- DESIGN ITEM:
- BOM:
- FAB DWG:
- PCB DWG:
- ASSY DWG:
- SCALE:
- A3
- SIZE
- CAGE CODE
- FILE NAME
- DWG NO.
- SHEET
- OF
- REV

### Library data of the parts
D1 = CMP-1426-00001-4: LED Low-Power Uni-Color Red 630nm 2V 2-Pin Chip 0603(1608Metric) T/R; Max Junction Temperature (Tj): 95°C; Dominant Wavelength: 625nm; Lens Style: Clear, Rectangular; Viewing Angle: 140°; Forward Current: 100mA; Max Reverse Voltage (DC): 5V; Luminous Intensity: 250mcd; Test Current: 20mA; Power Dissipation: 72mW; Max Operating Temperature: 85°C; Mount: Surface Mount; Height: 700µm; Packaging: Tape and Reel; REACH SVHC: Unknown; Case Code (Metric): 1608; Peak Wavelength: 630nm; Forward Voltage: 2V; Case/Package: 0603; Color: Red; RoHS: Compliant; Width: 800µm; Reverse Voltage: 5V; Min Operating Temperature: -40°C; Wavelength: 625nm; Case Code (Imperial): 0603; Length: 1.6mm
H1 H2 = CMP-002-00086-1: PC / 104 Connectors Elevated Socket Strip; Manufacturer_Name: SAMTEC; Design Item ID: ESQ-126-39-G-D-001; Mouser Price/Stock: https://www.mouser.co.uk/ProductDetail/Samtec/ESQ-126-39-G-D-001?qs=PB6%2FjmICvI2K%2FCIgL4SVbg%3D%3D; Mouser Part Number: 200-ESQ12639GD001; Source: SamacSys.SchLib; Arrow Price/Stock: https://www.arrow.com/en/products/esq-126-39-g-d-001/samtec?region=nac; Arrow Part Number: ESQ-126-39-G-D-001; Manufacturer_Part_Number: ESQ-126-39-G-D-001; Datasheet Link: http://suddendocs.samtec.com/catalog_english/esq_th.pdf; Height: 11.35mm
R3-R6 = CMP-2000-01851-2: RES 10K OHM 5% 1/10W 0603; Temperature Coefficient: 200ppm/°C; Voltage Rating: 50V; Power Rating: 100mW; Resistance: 10kR; Length: 1.6mm; Lead Free: Lead Free; Resistance Tolerance: 5%; Case Code (Metric): 1608; Width: 0.8mm; Height: 0.45mm; Max Operating Temperature: 155°C; RoHS Compliant: Yes; Resistor Type: Thick Film; Min Operating Temperature: -55°C; Case Code (Imperial): 0603; Technology: THICK FILM; Package Quantity: 5000; Tolerance: 5%; Case/Package: 0603; Voltage Rating (DC): 50V; Depth: 0.8mm; Packaging: Tape and Reel; Number of Pins: 2; Construction: Rectangular; Series: RK73B; Military Standard: Not; Termination: SMD/SMT
R17 = CMP-2000-00435-2: Chip Resistor, 330 Ohm, +/- 1%, 0.1 W, -55 to 155 degC, 0603 (1608 Metric), RoHS, Tape and Reel; Gender: Male; Mating Cycles: 10000; Current Rating: 500 mA; Voltage Rating: 10 V; REACH SVHC: No SVHC; PackageDescription: 2-Pin Surface Mount Device, Body 1.6 x 0.85 mm; Contact Finish: Gold; Pins: 8; ComponentLink1Description: Manufacturer URL; Packaging: Tape and Reel; Max Operating Temperature: 85 degC; Contact Material: Copper; Height: 1.45 mm; Width: 1.45 mm; DatasheetVersion: Apr-15; Package Quantity: 1500; Contact Plating: Gold; PackageReference: 0603; Mount: Surface Mount; Lead Pitch: 1.1 mm; Min Operating Temperature: -25 degC; ComponentLink1URL: http://www.panasonic.com/; ComponentLink2URL: http://industrial.panasonic.com/cdbs/www-data/pdf/RDA0000/AOA0000C86.pdf; Length: 13.7 mm; ComponentLink2Description: Datasheet; RoHSCompliant: true

## Sheet Ports.SchDoc
size 420 x 297 mm; SheetNumber: 13; SheetTotal: 13
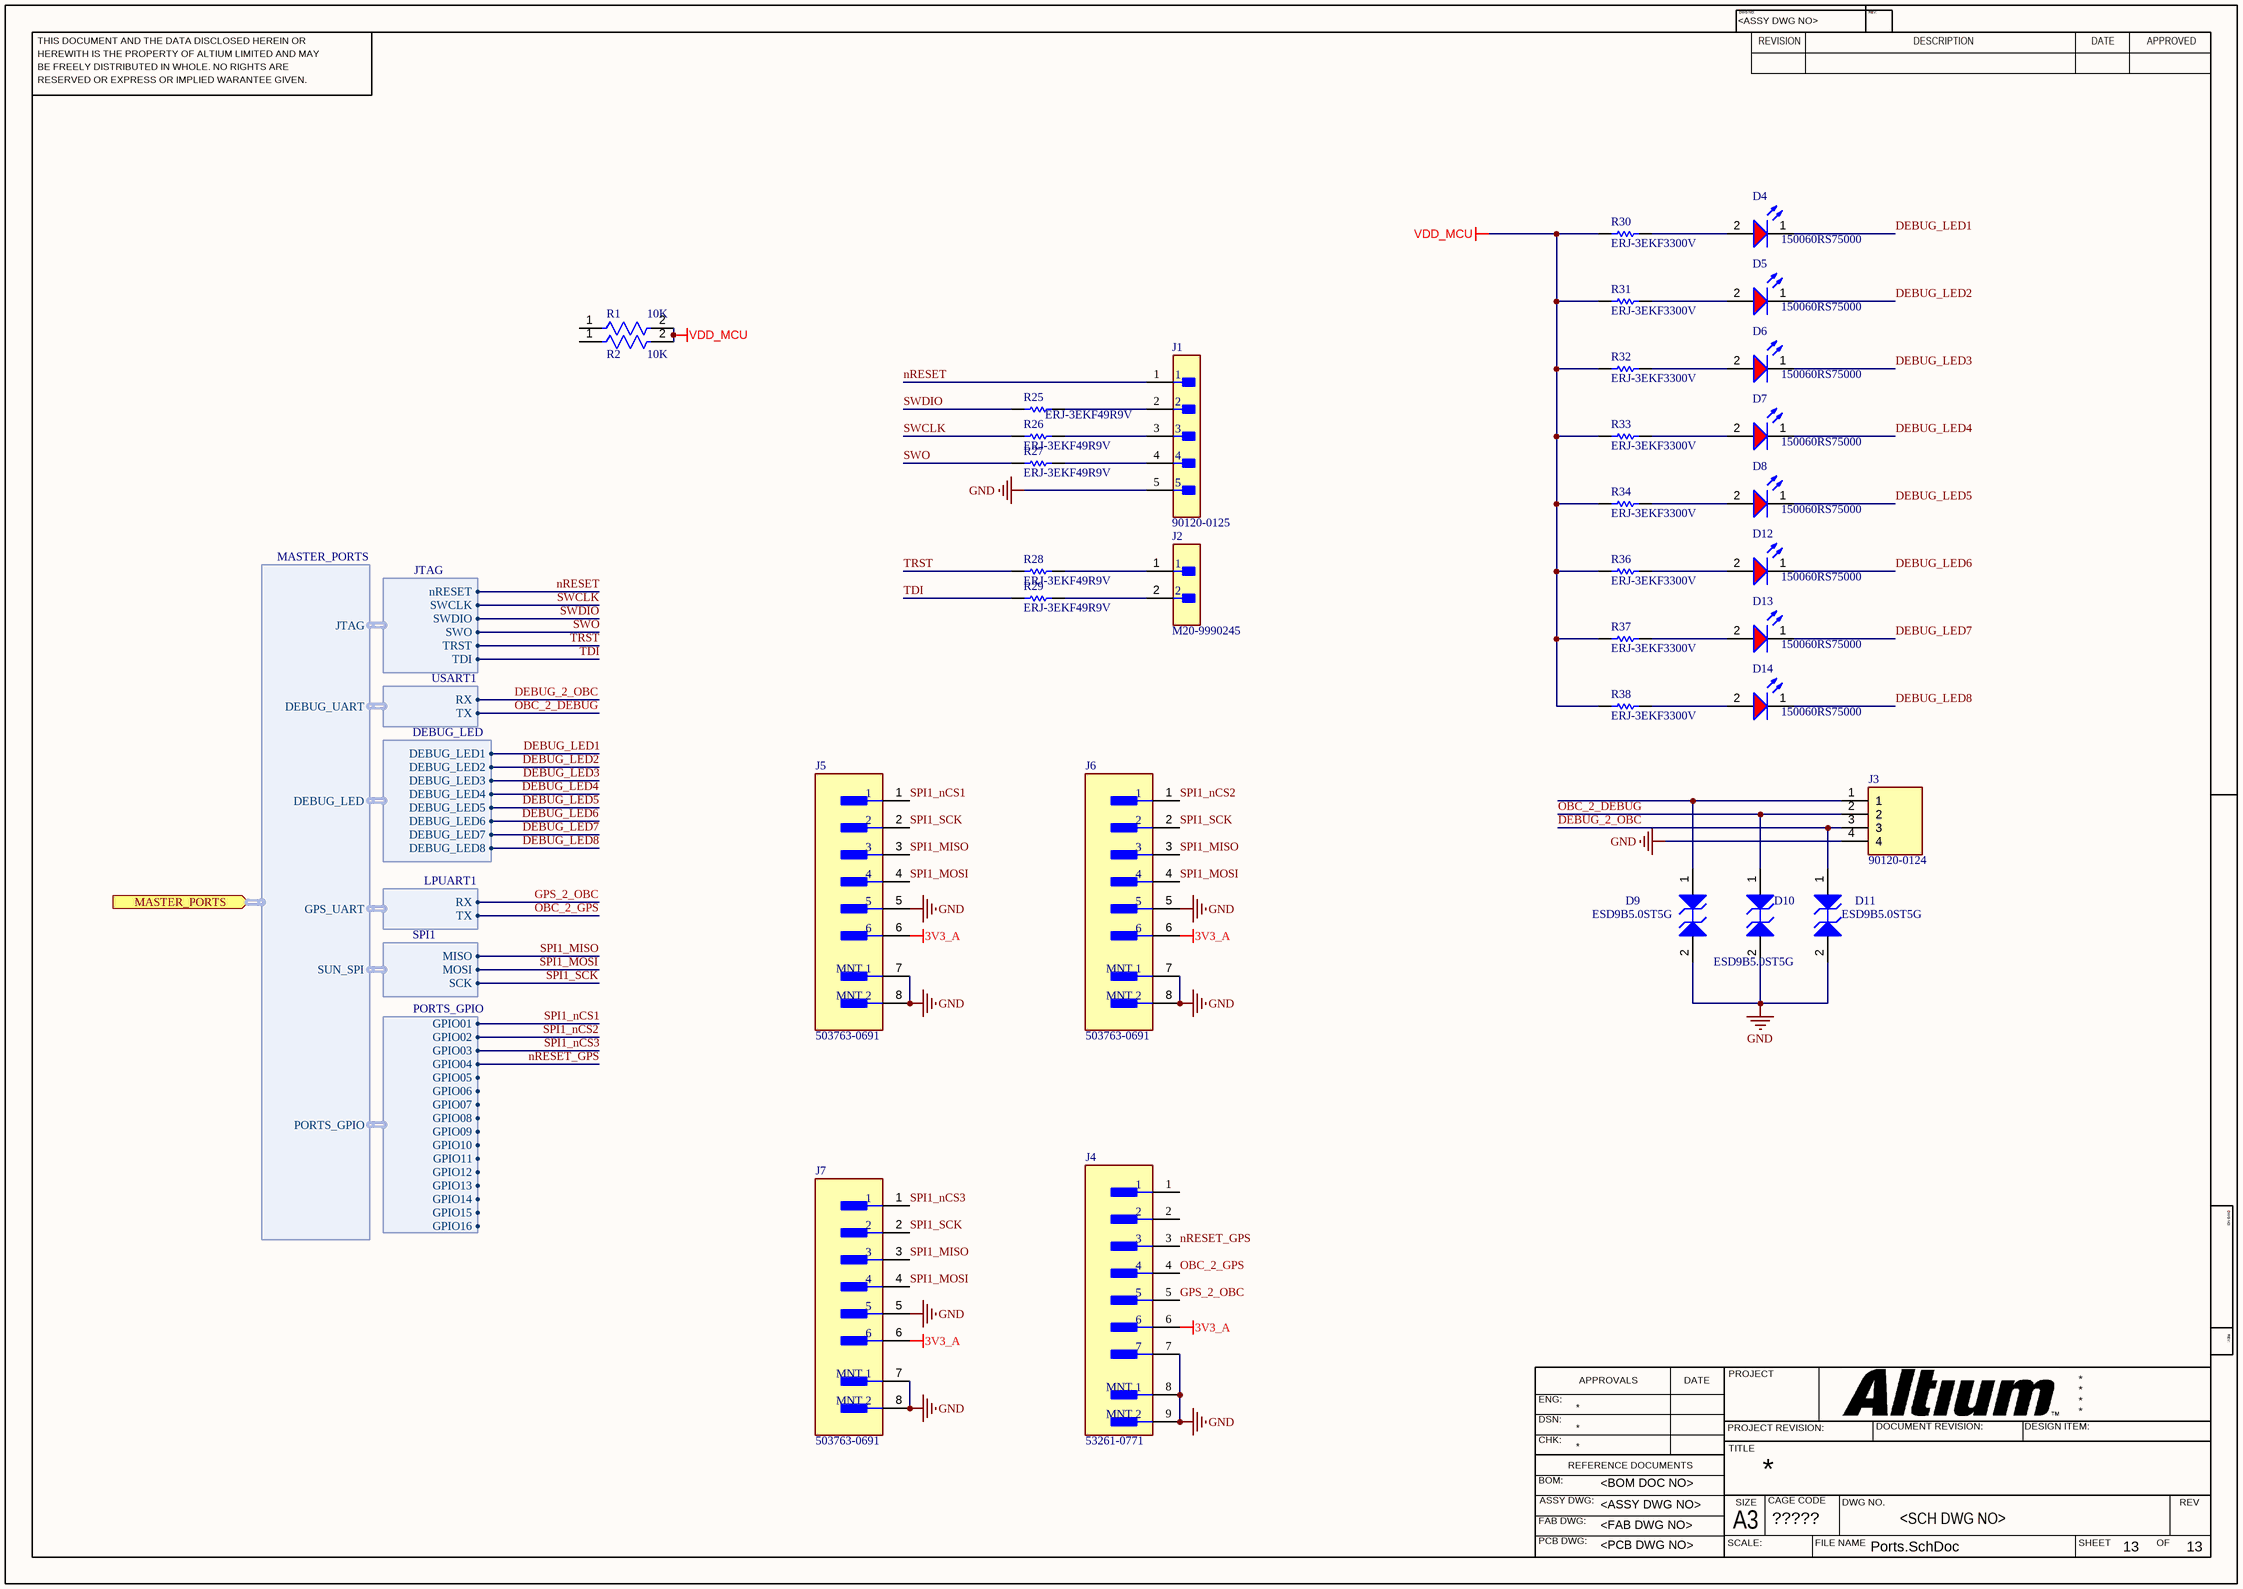
[diagram p4: Ports.SchDoc]

### Parts
D4  150060RS75000  [WL-SMCW_0603_150060xx75000]
D5  150060RS75000  [WL-SMCW_0603_150060xx75000]
D6  150060RS75000  [WL-SMCW_0603_150060xx75000]
D7  150060RS75000  [WL-SMCW_0603_150060xx75000]
D8  150060RS75000  [WL-SMCW_0603_150060xx75000]
D9  ESD9B5.0ST5G  [ONSC-SOD-923-2-514AB-01_V]
D10  ESD9B5.0ST5G  [ONSC-SOD-923-2-514AB-01_V]
D11  ESD9B5.0ST5G  [ONSC-SOD-923-2-514AB-01_V]
D12  150060RS75000  [WL-SMCW_0603_150060xx75000]
D13  150060RS75000  [WL-SMCW_0603_150060xx75000]
D14  150060RS75000  [WL-SMCW_0603_150060xx75000]
J1  90120-0125  [FP-90120-0125-MFG]
J2  M20-9990245  [FP-M20-9990245-MFG]
J3  90120-0124  [HDRV4W65P0X254_1X4_1016X254X945P]
J4  53261-0771  [FP-53261-0771-MFG]
J5  503763-0691  [FP-503763-0691-MFG]
J6  503763-0691  [FP-503763-0691-MFG]
J7  503763-0691  [FP-503763-0691-MFG]
R1  10K  [FP-RK73B1J-MFG]
R2  10K  [FP-RK73B1J-MFG]
R25  ERJ-3EKF49R9V  [RESC1608X55X30ML15T15]
R26  ERJ-3EKF49R9V  [RESC1608X55X30ML15T15]
R27  ERJ-3EKF49R9V  [RESC1608X55X30ML15T15]
R28  ERJ-3EKF49R9V  [RESC1608X55X30ML15T15]
R29  ERJ-3EKF49R9V  [RESC1608X55X30ML15T15]
R30  ERJ-3EKF3300V  [RESC1608X55X30LL15T15]
R31  ERJ-3EKF3300V  [RESC1608X55X30LL15T15]
R32  ERJ-3EKF3300V  [RESC1608X55X30LL15T15]
R33  ERJ-3EKF3300V  [RESC1608X55X30LL15T15]
R34  ERJ-3EKF3300V  [RESC1608X55X30LL15T15]
R36  ERJ-3EKF3300V  [RESC1608X55X30LL15T15]
R37  ERJ-3EKF3300V  [RESC1608X55X30LL15T15]
R38  ERJ-3EKF3300V  [RESC1608X55X30LL15T15]

### Ports
MASTER_PORTS (in, harness MASTER_PORTS)

### Harnesses
MASTER_PORTS: JTAG, DEBUG_UART, DEBUG_LED, GPS_UART, SUN_SPI, PORTS_GPIO
JTAG: nRESET, SWCLK, SWDIO, SWO, TDI, TRST
USART1: TX, RX
DEBUG_LED: DEBUG_LED1, DEBUG_LED2, DEBUG_LED3, DEBUG_LED4, DEBUG_LED5, DEBUG_LED6, DEBUG_LED7, DEBUG_LED8
LPUART1: TX, RX
SPI1: MOSI, MISO, SCK
PORTS_GPIO: GPIO01, GPIO02, GPIO03, GPIO04, GPIO05, GPIO06, GPIO07, GPIO08, GPIO09, GPIO10, GPIO11, GPIO12, GPIO13, GPIO14, GPIO15, GPIO16

### Nets
3V3_A: J4.6 J5.6 J6.6 J7.6
GND: D9.2(A2) D10.2(A2) D11.2(A2) J1.5 J3.4 J4.7 J4.8(MNT_1) J4.9(MNT_2) J5.5 J5.7(MNT_1) J5.8(MNT_2) J6.5 J6.7(MNT_1) J6.8(MNT_2) J7.5 J7.7(MNT_1) J7.8(MNT_2)
VDD_MCU: R1.2 R2.2 R30.1 R31.1 R32.1 R33.1 R34.1 R36.1 R37.1 R38.1
DEBUG_2_OBC: D11.1(A1) J3.3 ; harness USART1.RX
DEBUG_LED1: D4.1(K) ; harness DEBUG_LED.DEBUG_LED1
DEBUG_LED2: D5.1(K) ; harness DEBUG_LED.DEBUG_LED2
DEBUG_LED3: D6.1(K) ; harness DEBUG_LED.DEBUG_LED3
DEBUG_LED4: D7.1(K) ; harness DEBUG_LED.DEBUG_LED4
DEBUG_LED5: D8.1(K) ; harness DEBUG_LED.DEBUG_LED5
DEBUG_LED6: D12.1(K) ; harness DEBUG_LED.DEBUG_LED6
DEBUG_LED7: D13.1(K) ; harness DEBUG_LED.DEBUG_LED7
DEBUG_LED8: D14.1(K) ; harness DEBUG_LED.DEBUG_LED8
GPS_2_OBC: J4.5 ; harness LPUART1.RX
nRESET: J1.1 ; harness JTAG.nRESET
nRESET_GPS: J4.3 ; harness PORTS_GPIO.GPIO04
OBC_2_DEBUG: D10.1(A1) J3.2 ; harness USART1.TX
OBC_2_GPS: J4.4 ; harness LPUART1.TX
SPI1_MISO: J5.3 J6.3 J7.3 ; harness SPI1.MISO
SPI1_MOSI: J5.4 J6.4 J7.4 ; harness SPI1.MOSI
SPI1_nCS1: J5.1 ; harness PORTS_GPIO.GPIO01
SPI1_nCS2: J6.1 ; harness PORTS_GPIO.GPIO02
SPI1_nCS3: J7.1 ; harness PORTS_GPIO.GPIO03
SPI1_SCK: J5.2 J6.2 J7.2 ; harness SPI1.SCK
SWCLK: R26.1 ; harness JTAG.SWCLK
SWDIO: R25.1 ; harness JTAG.SWDIO
SWO: R27.1 ; harness JTAG.SWO
TDI: R29.1 ; harness JTAG.TDI
TRST: R28.1 ; harness JTAG.TRST
NetD4_2: D4.2(A) R30.2
NetD5_2: D5.2(A) R31.2
NetD6_2: D6.2(A) R32.2
NetD7_2: D7.2(A) R33.2
NetD8_2: D8.2(A) R34.2
NetD9_1: D9.1(A1) J3.1
NetD12_2: D12.2(A) R36.2
NetD13_2: D13.2(A) R37.2
NetD14_2: D14.2(A) R38.2
NetJ1_2: J1.2 R25.2
NetJ1_3: J1.3 R26.2
NetJ1_4: J1.4 R27.2
NetJ2_1: J2.1 R28.2
NetJ2_2: J2.2 R29.2

Not connected (* = marked no-connect by the designer): J4 1 2; R1 1; R2 1

### Notes on the sheet
- THIS DOCUMENT AND THE DATA DISCLOSED HEREIN OR
- HEREWITH IS THE PROPERTY OF ALTIUM LIMITED AND MAY
- DWG NO:
- REVISION
- REV:
- DESCRIPTION
- DATE
- APPROVED
- BE FREELY DISTRIBUTED IN WHOLE. NO RIGHTS ARE
- RESERVED OR EXPRESS OR IMPLIED WARANTEE GIVEN.
- ENG:
- APPROVALS
- PROJECT
- DSN:
- CHK:
- REFERENCE DOCUMENTS
- PROJECT REVISION:
- TITLE
- DOCUMENT REVISION:
- DESIGN ITEM:
- BOM:
- FAB DWG:
- PCB DWG:
- ASSY DWG:
- SCALE:
- A3
- SIZE
- CAGE CODE
- FILE NAME
- DWG NO.
- SHEET
- OF
- REV

### Library data of the parts
D4-D8 D12-D14 = CMP-1426-00001-4: as D1 on sheet PC104_52-52; Max Operating Temperature: 85°C; Mount: Surface Mount; Height: 700µm; Packaging: Tape and Reel; REACH SVHC: Unknown; Case Code (Metric): 1608; Peak Wavelength: 630nm; Forward Voltage: 2V; Case/Package: 0603; Color: Red; RoHS: Compliant; Width: 800µm; Reverse Voltage: 5V; Min Operating Temperature: -40°C; Wavelength: 625nm; Case Code (Imperial): 0603; Length: 1.6mm
D9-D11 = CMP-1063-00119-1: Transient Voltage Suppressor, Micro-Packaged Diode for ESD Protection, 2-Pin SOD-923, Pb-Free, Tape and Reel; Manufacturer: On Semiconductor; Number of Lines: 1; Direction: Bidirectional; V(BR) Min (V): 5.8; VRWM Max (V): 5; Packing: Tape and Reel; PackageDescription: 2-Pin SOD, Body 0.8 x 0.6 mm; IR Max (uA): 1; ComponentLink3Description: Package Specification; PartNumber: ESD9B5.0ST5G; ComponentLink1URL: http://www.onsemi.com/; RoHS: Pb-Free; Mounting Technology: Surface Mount; DatasheetVersion: Rev. 2; ComponentLink2URL: http://www.onsemi.cn/pub_link/Collateral/ESD9B-D.PDF; ComponentLink3URL: http://www.onsemi.com/pub_link/Collateral/514AB.PDF; PackageReference: SOD-923-2-514AB-01; PackageVersion: Rev. C, 03/2011; ComponentLink1Description: Manufacturer URL; ComponentLink2Description: Datasheet
J1 = CMP-00257-00655425-1: 90120-0125 2.54mm Pitch C-Grid III Header, Single Row, Vertical, 5 Circuits, Tin (Sn) Plating; NexarPartId: 655425; Manufacturer Lifecycle Status: ACTIVE; Lead Length: 2.9mm; Number of Positions: 5; Current Rating: 3A; Mating Post Length: 6.75mm; Glow Wire Compliant: Non-compliant; Contact Resistance: 20mΩ; Voltage Rating: 350V; Gender: Male; Max Voltage Rating (DC): 350.35kV; Max Operating Temperature: 125°C; Number of Pins: 5; Plating: Tin; Contact Material: Brass; Mount: Through Hole; Contact Gender: Male; Packaging: Bulk; Schedule B: 8536694040; Lifecycle Status: Production; Lead Pitch: 2.54mm; Radiation Hardening: No; Orientation: Vertical; Min Operating Temperature: -55°C; Country of Origin: SK; Housing Color: Black; REACH SVHC: No SVHC; Contact Plating: Tin; Number of Rows: 1; Number of Circuits: 5; Termination: Solder; Number of Contacts: 5; Pitch: 2.54mm; Housing Material: Polyester; RoHS: Compliant; Lead Free: Lead Free; Voltage Rating (AC): 350V
J2 = CMP-15831-000105-1: CONN HEADER VERT 2POS 2.54MM; Working Voltage: 750V; Gender: Male; Number of Poles: 2; Current Rating: 3A; Mated Stacking Heights: 16.54mm; Contact Resistance: 25mR; Connector Type: Male Pin; Insulation Resistance: 10GR; Mating Cycles: 300; Voltage: 50V; Flammability Rating: UL94 V-0; Pitch: 2.54mm; Series: M20; Number of Contacts: 2; Height: 0.12inch; Min Operating Temperature: -40°C; Contact Finish - Mating: GOLD; Number of Positions: 2; Number of Rows: 1; Packaging: Bulk; Package Quantity: 1000; Voltage Rating (AC): 750V; Current: 3A; Mount: Through Hole; Case/Package: SIL; Orientation: Straight; Contact Shape: Square; Weight: 0.25lb; Radiation Hardening: No; Fastening Type: Pull; Length: 5.08mm; Depth: 2.54mm; Contact Mating Length: 0.24inch; Housing Material: Nylon; Reach SVHC Compliant: Yes; Insulation Material: Nylon; Color: Black; Width: 0.25inch; Insulation Color: Black; Contact Material: Brass; Contact Type: Male Pin; Termination: Solder; Max Operating Temperature: 105°C; Contact Plating: Gold; Housing Color: Black; Max Current Rating: 3A; Lead Pitch: 2.54mm
J3 = 90120-0124: Connector; Manufacturer_Name: Molex; Datasheet Link: https://componentsearchengine.com/Datasheets/2/90120-0124.pdf; Height: 9.45mm; Manufacturer_Part_Number: 90120-0124; Mouser Part Number: 538-90120-0124; Mouser Price/Stock: https://www.mouser.co.uk/ProductDetail/Molex/90120-0124?qs=PvP5v7EimsmprSEogp1JLQ%3D%3D
J4 = CMP-04776-000278-1: CONN HEADER SMD R/A 7POS 1.25MM; Voltage Rating (AC): 125V; Number of Contacts: 7; Connector Type: Blade Pin; Body Plating: Tin; Insulation Resistance: 100MR; Current Rating: 1A; Contact Resistance: 20mR; Min Operating Temperature: -40°C; Contact Gender: Male; Contact Material: Bronze; Number of Positions: 7; Radiation Hardening: No; Packaging: Tape and Reel; Pitch: 1.25mm; Flammability Rating: UL94 V-0; Orientation: Right Angle; Color: Natural; Number of Rows: 1; Series: PicoBlade; Length: 13.9mm; Lead Pitch: 1.25mm; Contact Type: Blade Pin; Mount: Surface Mount; Depth: 5.2mm; Housing Material: Nylon; Contact Plating: Tin; Working Voltage: 125V; Max Operating Temperature: 85°C; Voltage Rating: 125V; RoHS Compliant: Yes; Housing Color: Natural; Termination: Solder
J5-J7 = CMP-04776-000530-1: CONN HEADER SMD R/A 6POS 1MM
R1 R2 = CMP-2000-01851-2: as R3 on sheet PC104_52-52; Length: 1.6mm; Lead Free: Lead Free; Resistance Tolerance: 5%; Case Code (Metric): 1608; Width: 0.8mm; Height: 0.45mm; Max Operating Temperature: 155°C; RoHS Compliant: Yes; Resistor Type: Thick Film; Min Operating Temperature: -55°C; Case Code (Imperial): 0603; Technology: THICK FILM; Package Quantity: 5000; Tolerance: 5%; Case/Package: 0603; Voltage Rating (DC): 50V; Depth: 0.8mm; Packaging: Tape and Reel; Number of Pins: 2; Construction: Rectangular; Series: RK73B; Military Standard: Not; Termination: SMD/SMT
R25-R29 = CMP-2000-00538-1: Manufacturer: Panasonic; Part Number: ERJ-3EKF49R9V
R30-R34 R36-R38 = CMP-2000-00435-2: as R17 on sheet PC104_52-52; REACH SVHC: No SVHC; PackageDescription: 2-Pin Surface Mount Device, Body 1.6 x 0.85 mm; Contact Finish: Gold; Pins: 8; ComponentLink1Description: Manufacturer URL; Packaging: Tape and Reel; Max Operating Temperature: 85 degC; Contact Material: Copper; Height: 1.45 mm; Width: 1.45 mm; DatasheetVersion: Apr-15; Package Quantity: 1500; Contact Plating: Gold; PackageReference: 0603; Mount: Surface Mount; Lead Pitch: 1.1 mm; Min Operating Temperature: -25 degC; ComponentLink1URL: http://www.panasonic.com/; ComponentLink2URL: http://industrial.panasonic.com/cdbs/www-data/pdf/RDA0000/AOA0000C86.pdf; Length: 13.7 mm; ComponentLink2Description: Datasheet; RoHSCompliant: true

## Nets that join several sheets
3V3_A: PC104_52-52 (H1.47 H1.48 H1.49), Ports (J4.6 J5.6 J6.6 J7.6)
GND: MCU (U11.2 U12.2 U13.2), MCU_Power (30 pins), PC104_52-52 (9 pins), Ports (17 pins)
VDD_MCU: MCU (U11.5 U12.5 U13.5), MCU_Power (32 pins), PC104_52-52 (6 pins), Ports (10 pins)
A_2_OBC: MCU (U11.1), PC104_52-52 (H1.7)
B_2_OBC: MCU (U11.3), PC104_52-52 (H1.8)
DEBUG_2_OBC: MCU (U13.1), Ports (D11.1 J3.3)
DEBUG_LED1: MCU (U0.56), Ports (D4.1)
DEBUG_LED2: MCU (U0.57), Ports (D5.1)
DEBUG_LED3: MCU (U0.87), Ports (D6.1)
DEBUG_LED4: MCU (U0.88), Ports (D7.1)
DEBUG_LED5: MCU (U0.89), Ports (D8.1)
DEBUG_LED6: MCU (U0.90), Ports (D12.1)
DEBUG_LED7: MCU (U0.91), Ports (D13.1)
DEBUG_LED8: MCU (U0.127), Ports (D14.1)
ESP_2_OBC: MCU (U12.3), PC104_52-52 (H1.15)
GPS_2_OBC: MCU (U13.3), Ports (J4.5)
I2C2_SCL: MCU (U0.11), PC104_52-52 (H1.21 R3.1)
I2C2_SDA: MCU (U0.10), PC104_52-52 (H1.23 R4.1)
I2C3_SCL: MCU (U0.92), PC104_52-52 (H1.43 R5.1)
I2C3_SDA: MCU (U0.99), PC104_52-52 (H1.41 R6.1)
nRESET: MCU_Power (U0.25), Ports (J1.1)
OBC_2_A: MCU (R7.1), PC104_52-52 (H1.5)
OBC_2_B: MCU (R8.1), PC104_52-52 (H1.6)
OBC_2_DEBUG: MCU (R11.1), Ports (D10.1 J3.2)
OBC_2_EPS: MCU (R9.1), PC104_52-52 (H1.13)
OBC_2_GPS: MCU (R12.1), Ports (J4.4)
OBC_2_SR: MCU (R10.1), PC104_52-52 (H1.22)
SPI1_MISO: MCU (U0.67), Ports (J5.3 J6.3 J7.3)
SPI1_MOSI: MCU (U0.68), Ports (J5.4 J6.4 J7.4)
SPI1_SCK: MCU (U0.66), Ports (J5.2 J6.2 J7.2)
SR_2_OBC: MCU (U12.1), PC104_52-52 (H1.24)
SWCLK: MCU (U0.109), Ports (R26.1)
SWDIO: MCU (U0.110), Ports (R25.1)
SWO: MCU (U0.133), Ports (R27.1)
TDI: MCU (U0.105), Ports (R29.1)
TRST: MCU (U0.134), Ports (R28.1)
UART_A_CTS: MCU (U0.117), PC104_52-52 (H1.11)
UART_A_RTS: MCU (U0.118), PC104_52-52 (H1.9)
UART_B_CTS: MCU (U0.80), PC104_52-52 (H1.12)
UART_B_RTS: MCU (U0.47), PC104_52-52 (H1.10)